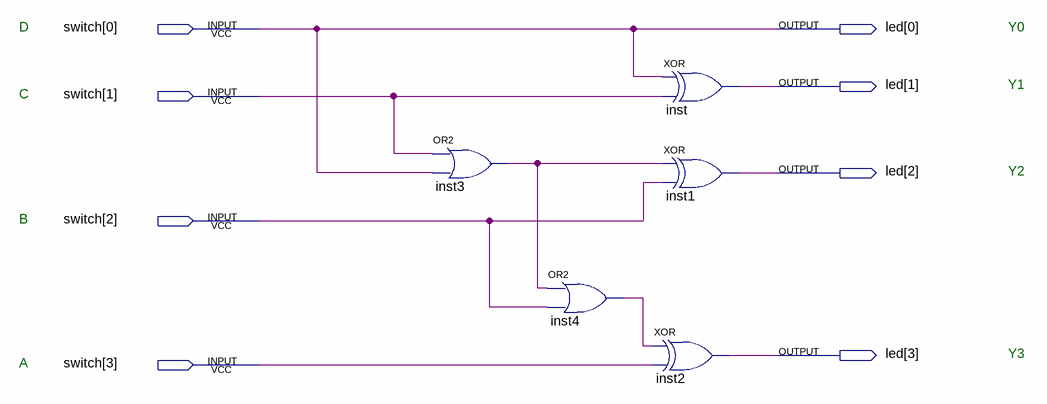
[diagram p0: schematic sheet]
// Quartus schematic pj301.bdf as structural Verilog: 5 symbols, 8 pins
module pj301 (
  input  [3:0] switch,
  output [3:0] led
);

  wire inst3_out, inst4_out;

  or inst3 (inst3_out, switch[1], switch[0]);
  or inst4 (inst4_out, inst3_out, switch[2]);
  xor inst (led[1], switch[0], switch[1]);
  xor inst1 (led[2], inst3_out, switch[2]);
  xor inst2 (led[3], inst4_out, switch[3]);

  assign led[0] = switch[0];

  // Notes on the sheet:
  //   D
  //   Y0
  //   Y1
  //   C
  //   Y2
  //   B
  //   Y3
  //   A
endmodule
